# EAGLE design Motor_PCB (EAGLE 7.2.0)
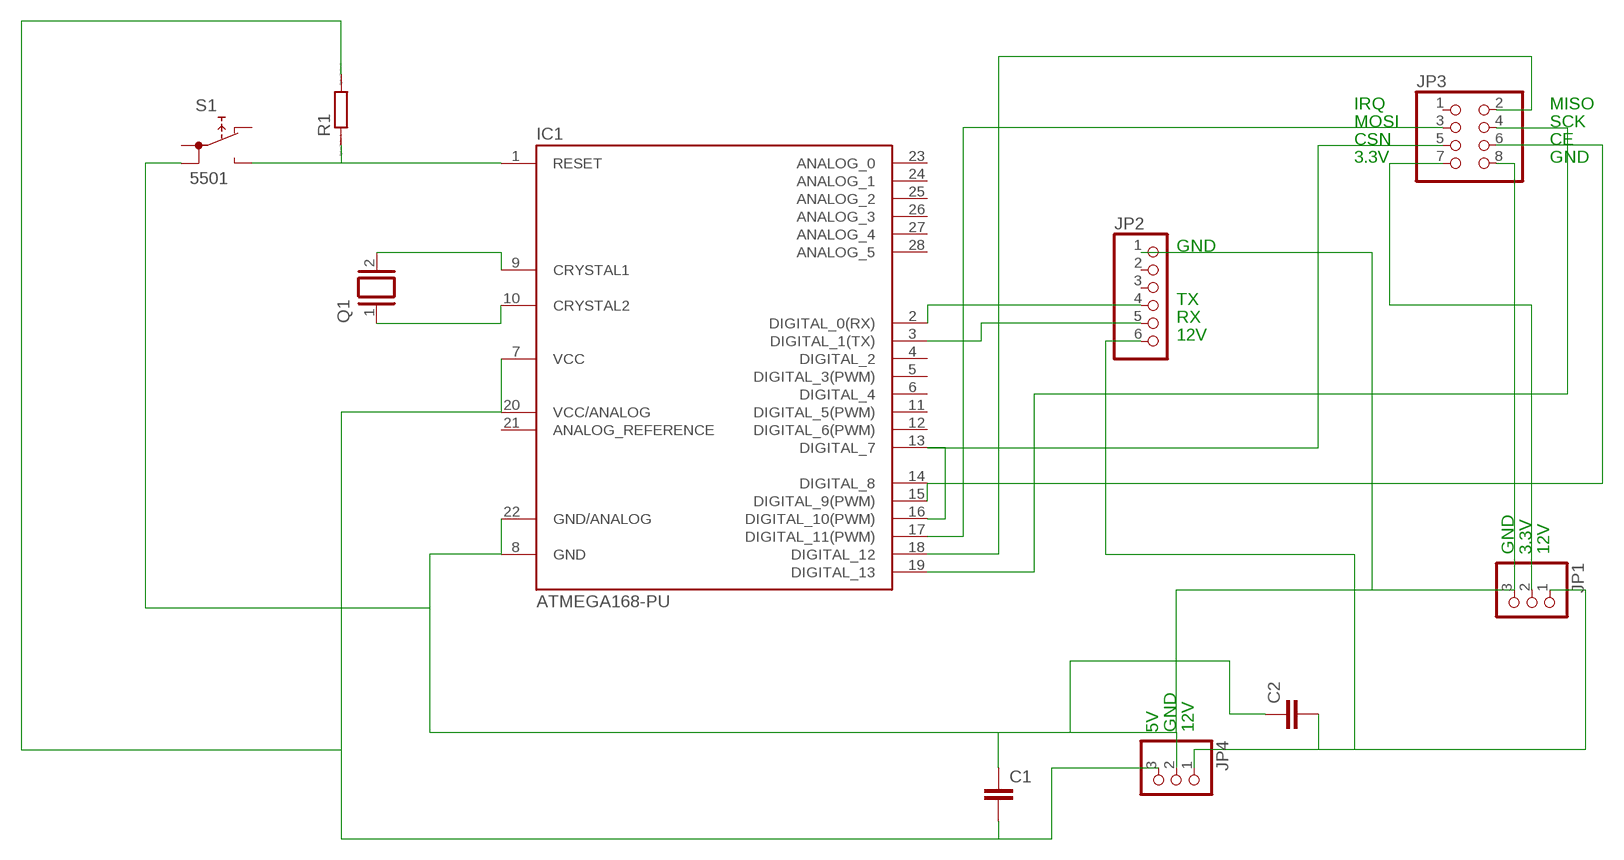
[diagram p0: schematic, sheet 1]

## Parts
C1  C2,5-3  [C2.5-3]
C2  C2,5-3  [C2.5-3]
IC1  ATMEGA168-PU  [DIL28-3]
JP1  PINHD-1X3  [1X03]
JP2  PINHD-1X6  [1X06]
JP3  PINHD-2X4  [2X04]
JP4  PINHD-1X3  [1X03]
Q1  XTAL/S  [QS]
R1  R0207/10  [0207/10]
S1  5501  [5501]

## Nets
N$1: IC1.9(CRYSTAL1) Q1.2
N$2: IC1.10(CRYSTAL2) Q1.1
N$3: C1.2 IC1.7(VCC) IC1.20(VCC/ANALOG) JP4.3 R1.2
N$4: C1.1 C2.1 IC1.8(GND) IC1.22(GND/ANALOG) JP1.3 JP2.1 JP3.8 JP4.2 S1.1B
N$5: IC1.1(RESET) R1.1 S1.NO
N$6: C2.2 JP1.1 JP2.6 JP4.1
N$7: IC1.17(DIGITAL_11(PWM)) JP3.3
N$8: IC1.18(DIGITAL_12) JP3.2
N$9: IC1.13(DIGITAL_7) IC1.16(DIGITAL_10(PWM)) JP3.5
N$10: IC1.2(DIGITAL_0(RX)) JP2.4
N$11: IC1.3(DIGITAL_1(TX)) JP2.5
N$12: JP1.2 JP3.7
N$13: IC1.14(DIGITAL_8) IC1.15(DIGITAL_9(PWM)) JP3.6
N$14: IC1.19(DIGITAL_13) JP3.4
Unconnected: IC1.4(DIGITAL_2) IC1.5(DIGITAL_3(PWM)) IC1.6(DIGITAL_4) IC1.11(DIGITAL_5(PWM)) IC1.12(DIGITAL_6(PWM)) IC1.21(ANALOG_REFERENCE) IC1.23(ANALOG_0) IC1.24(ANALOG_1) IC1.25(ANALOG_2) IC1.26(ANALOG_3) IC1.27(ANALOG_4) IC1.28(ANALOG_5) JP2.2 JP2.3 JP3.1 S1.1A S1.NC

## Notes on the sheet
- IRQ | MISO
- MOSI | SCK
- CSN | CE
- 3.3V | GND
- GND
- TX
- RX
- 12V
- GND | 3.3V | 12V
- 5V | GND | 12V

## Library data of the parts
C1 C2 = capacitor-wima:C: CAPACITOR naming: grid - package width
IC1 = Arduino-AVR:ATMEGA168-PU
JP1 JP4 = pinhead:PINHD-1X3: PIN HEADER
JP2 = pinhead:PINHD-1X6: PIN HEADER
JP3 = pinhead:PINHD-2X4: PIN HEADER
Q1 = special:XTAL/S: CRYSTAL
R1 = eagle-ltspice:R: RESISTOR, European symbol; SPICEMODEL: NONE; SPICEPREFIX: R
S1 = switch:55?: PUSHBUTTON SERIES 5500 SWITCHES Source: www.e-switch.com .. 5500.pdf

## Board
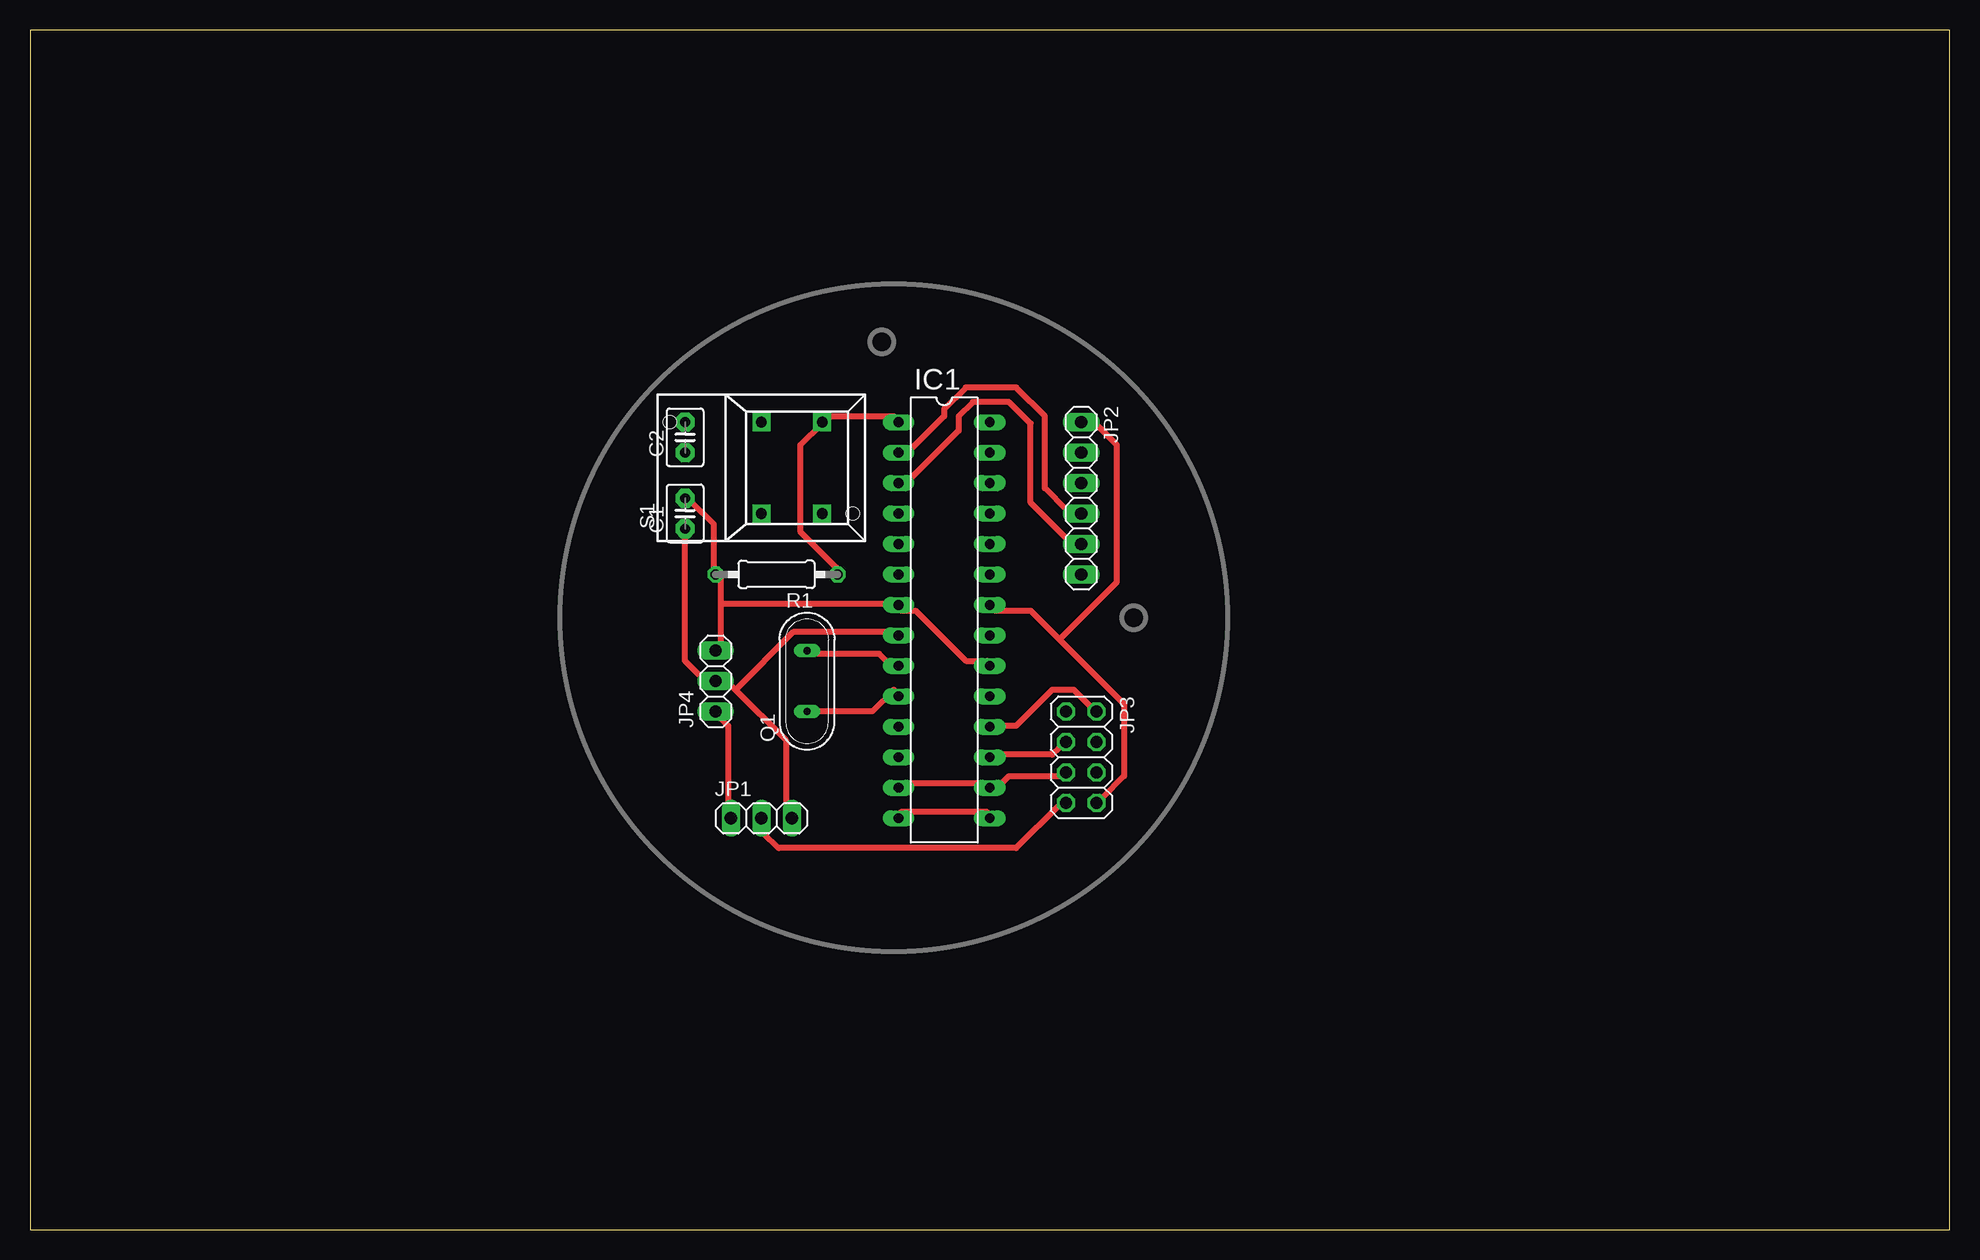
[diagram p1: board, top side]
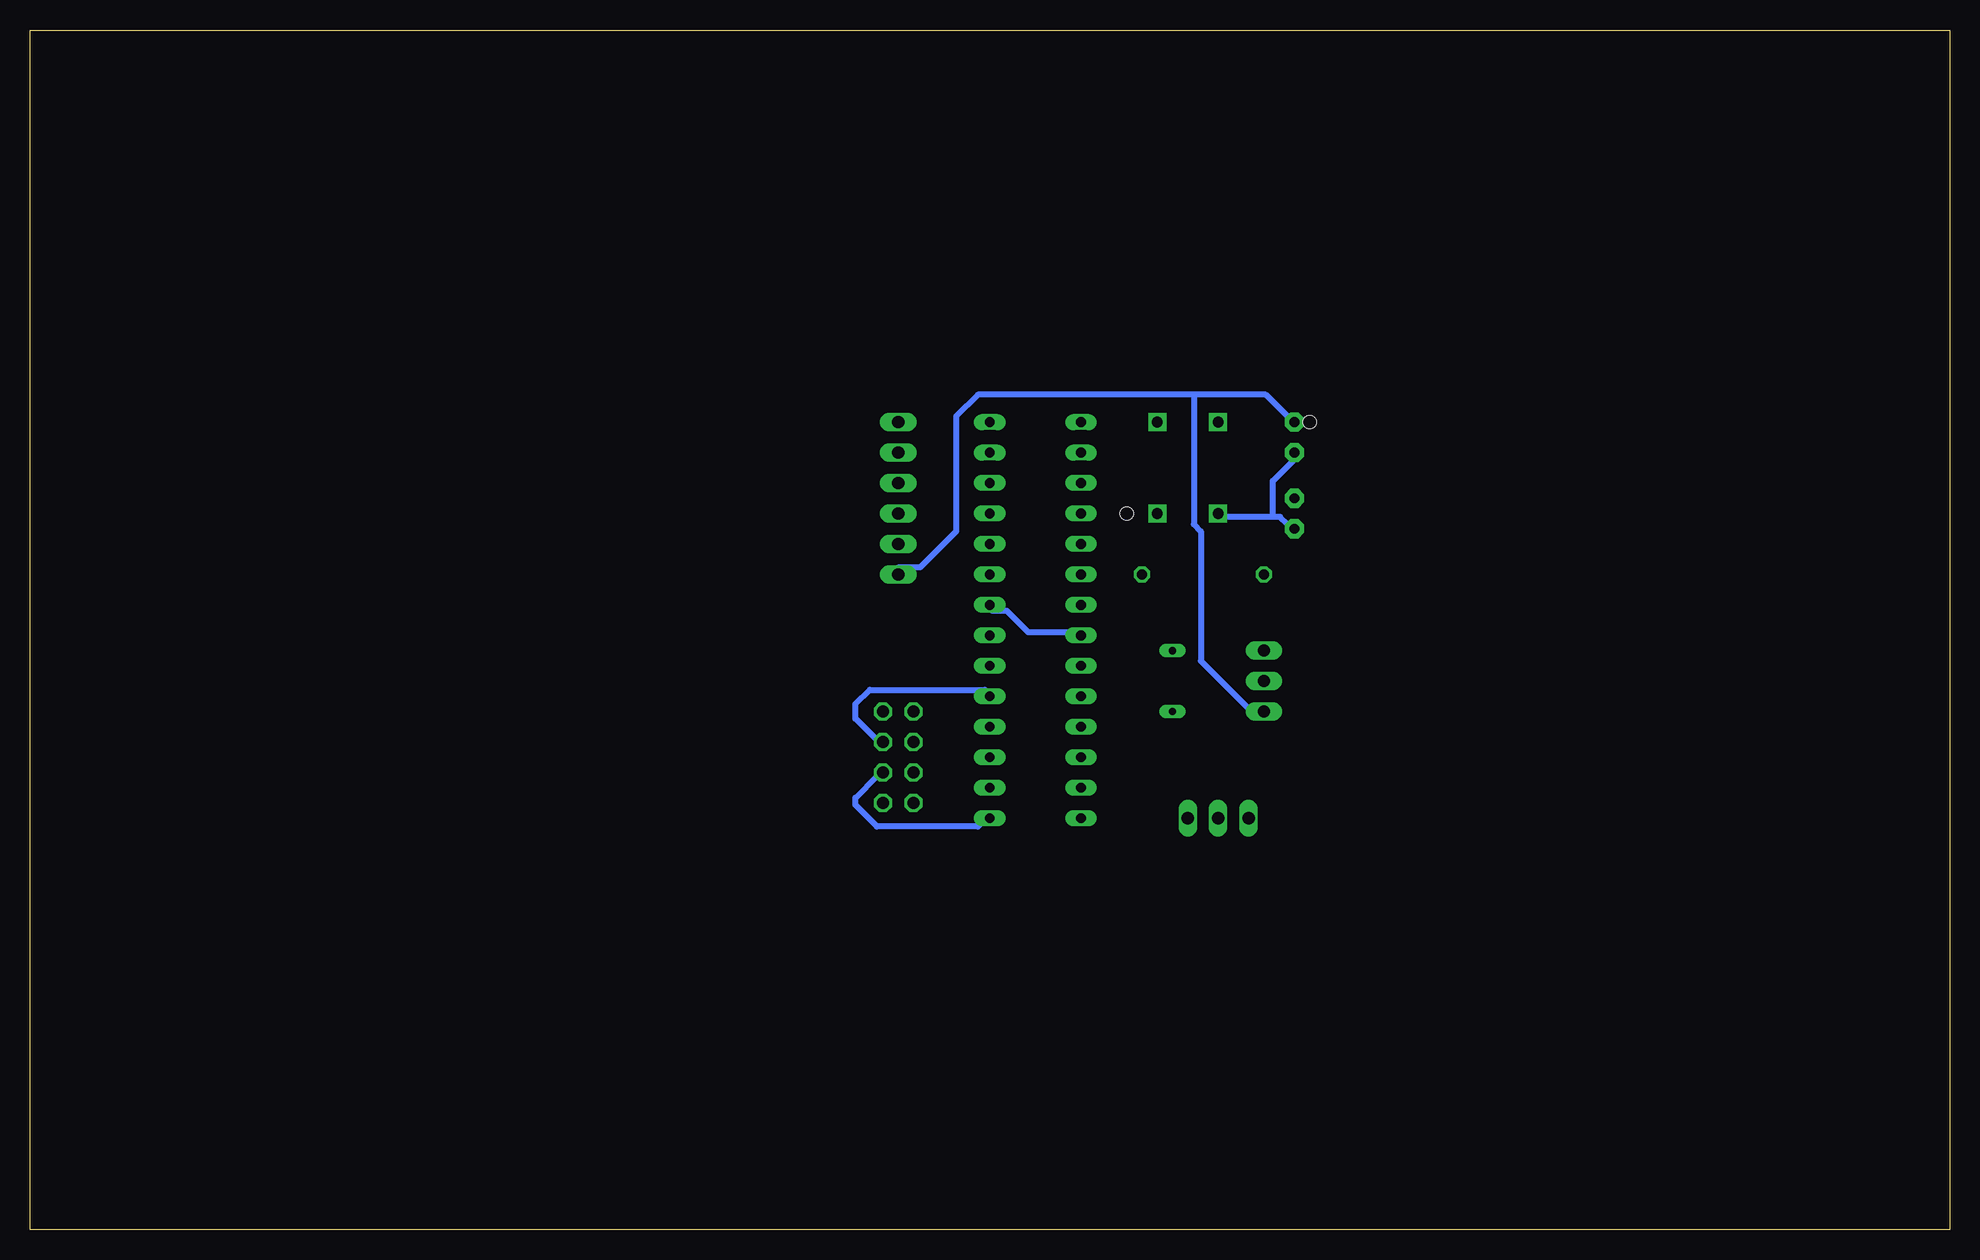
[diagram p2: board, bottom side, seen from below]

Size 160 x 100 mm. Coordinates in mm from the lower left corner, seen from the top.
Outline: 0,0 160,0 160,100 0,100 0,0
Copper layers (1*16): Top 0.035mm / dielectric 1.5mm / Bottom 0.035mm
Design rules "default *": minimum track width 0.5mm, minimum drill 24mil, track to track 0.7mm, track to pad 0.7mm, pad to pad 0.7mm, via to via 0.7mm, smd to smd 0.7mm, copper to edge 40mil, drill to drill 8mil, minimum pad ring 10mil, minimum via ring 8mil, stop-mask expansion 4mil, vias tented up to drill 0mil, thermal gap 10mil

### Footprints (pad centres in the part's own frame; a part is rotated, then mirrored left to right if it is on the bottom)
C2.5-3 = drill 0.813 pad 1.6 octagon: 1 -1.27,0; 2 1.27,0
DIL28-3 = drill 0.813 long: 1 -16.51,-3.81; 2 -13.97,-3.81; 3 -11.43,-3.81; 4 -8.89,-3.81; 5 -6.35,-3.81; 6 -3.81,-3.81; 7 -1.27,-3.81; 8 1.27,-3.81; 9 3.81,-3.81; 10 6.35,-3.81; 11 8.89,-3.81; 12 11.43,-3.81; 13 13.97,-3.81; 14 16.51,-3.81; 15 16.51,3.81; 16 13.97,3.81; 17 11.43,3.81; 18 8.89,3.81; 19 6.35,3.81; 20 3.81,3.81; 21 1.27,3.81; 22 -1.27,3.81; 23 -3.81,3.81; 24 -6.35,3.81; 25 -8.89,3.81; 26 -11.43,3.81; 27 -13.97,3.81; 28 -16.51,3.81
1X03 = drill 1.016 long: 1 -2.54,0; 2 0,0; 3 2.54,0
1X06 = drill 1.016 long: 1 -6.35,0; 2 -3.81,0; 3 -1.27,0; 4 1.27,0; 5 3.81,0; 6 6.35,0
2X04 = drill 1.016 octagon: 1 -3.81,-1.27; 2 -3.81,1.27; 3 -1.27,-1.27; 4 -1.27,1.27; 5 1.27,-1.27; 6 1.27,1.27; 7 3.81,-1.27; 8 3.81,1.27
QS = drill 0.61 long: 1 -2.54,0; 2 2.54,0
0207/10 = drill 0.813 octagon: 1 -5.08,0; 2 5.08,0
5501 = drill 0.9 pad 1.5 square: 1A 0,3.81; 1B 0,-3.81; NC 5.08,-3.81; NO 5.08,3.81 | hole 1.1: -7.62,3.81; 7.62,-3.81

### Placement (x,y rotation side)
C1  54.61,59.69 90 top
C2  54.61,66.04 90 top
IC1  76.2,50.8 270 top
JP1  60.96,34.29 0 top
JP2  87.63,60.96 270 top
JP3  87.63,39.37 270 top
JP4  57.15,45.72 90 top
Q1  64.77,45.72 90 top
R1  62.23,54.61 180 top
S1  60.96,63.5 0 top

### Tracks (layer width: path | path; a pad name or v marks a point on that pad's centre or on a via)
N$1
  Top 0.5: Q1.2 64.8,48 70.8,48 72,46.8 IC1.9
N$2
  Top 0.5: Q1.1 64.8,43.2 70.2,43.2 72,45 IC1.10
N$3
  Top 0.5: IC1.20 79.8,47.4 78,47.4 73.8,51.6 72.6,51.6 IC1.7 72,52.2 57.6,52.2 | 57.6,52.2 57.6,48.6 JP4.3 | 57.6,52.2 57.6,54.6 R1.2 57,55.2 57,58.8 55.2,60.6 C1.2
N$4
  Top 0.5: 58.8,45 57.6,46.2 JP4.2 57,46.2 55.8,46.2 54.6,47.4 54.6,58.2 C1.1 | 58.8,45 63,40.8 63,34.8 JP1.3 | 85.8,49.2 83.4,51.6 80.4,51.6 IC1.22 | 85.8,49.2 91.2,43.8 91.2,37.8 89.4,36 JP3.8 | 85.8,49.2 90.6,54 90.6,65.4 88.8,67.2 88.2,67.2 JP2.1 | 58.8,45 63.6,49.8 72,49.8 IC1.8
  Bottom 0.5: 56.4,59.4 55.8,59.4 55.2,58.8 C1.1 | 56.4,59.4 60.6,59.4 S1.1B | 56.4,59.4 56.4,62.4 54.6,64.2 C2.1 | IC1.8 72.6,49.8 76.8,49.8 78.6,51.6 79.8,51.6 IC1.22
N$5
  Top 0.5: R1.1 67.2,55.2 64.2,58.2 64.2,65.4 66,67.2 S1.NO 66.6,67.8 72,67.8 IC1.1
N$6
  Top 0.5: JP1.1 58.2,34.8 58.2,42 57.6,42.6 JP4.1
  Bottom 0.5: 63,69.6 57,69.6 55.2,67.8 C2.2 | 63,69.6 81,69.6 82.8,67.8 82.8,58.2 85.8,55.2 87.6,55.2 JP2.6 | 63,69.6 63,58.8 62.4,58.2 62.4,47.4 58.2,43.2 57.6,43.2 JP4.1
N$7
  Top 0.5: IC1.17 80.4,39.6 85.2,39.6 85.8,40.2 JP3.3
N$8
  Top 0.5: IC1.18 80.4,42 82.2,42 85.2,45 87,45 88.8,43.2 JP3.2
N$9
  Top 0.5: IC1.13 72.6,37.2 79.8,37.2 IC1.16 80.4,36.6 81.6,37.8 85.8,37.8 JP3.5
N$10
  Top 0.5: IC1.2 72.6,64.8 73.2,64.8 76.2,67.8 76.2,68.4 78,70.2 82.2,70.2 84.6,67.8 84.6,61.8 86.4,60 87.6,60 JP2.4
N$11
  Top 0.5: IC1.3 72.6,62.4 73.2,62.4 77.4,66.6 77.4,67.8 78.6,69 81.6,69 83.4,67.2 83.4,60.6 86.4,57.6 87.6,57.6 JP2.5
N$12
  Top 0.5: JP1.2 61.2,34.2 61.2,33 62.4,31.8 82.2,31.8 85.8,35.4 JP3.7
N$13
  Top 0.5: IC1.14 72.6,34.8 79.8,34.8 IC1.15
  Bottom 0.5: JP3.6 89.4,37.8 91.2,36 91.2,35.4 89.4,33.6 81,33.6 80.4,34.2 IC1.15
N$14
  Bottom 0.5: IC1.19 80.4,45 90,45 91.2,43.8 91.2,42.6 89.4,40.8 JP3.4

### Text on the board
tDocu: G | 10 | 1 | T | R | 12 | 5 | G | 12 | IEEE UPP FUNDED | 12 | 3 | G | 3 | G | SRL - NASA